# Altium schematic sheet TestV01.SchDoc
size A3
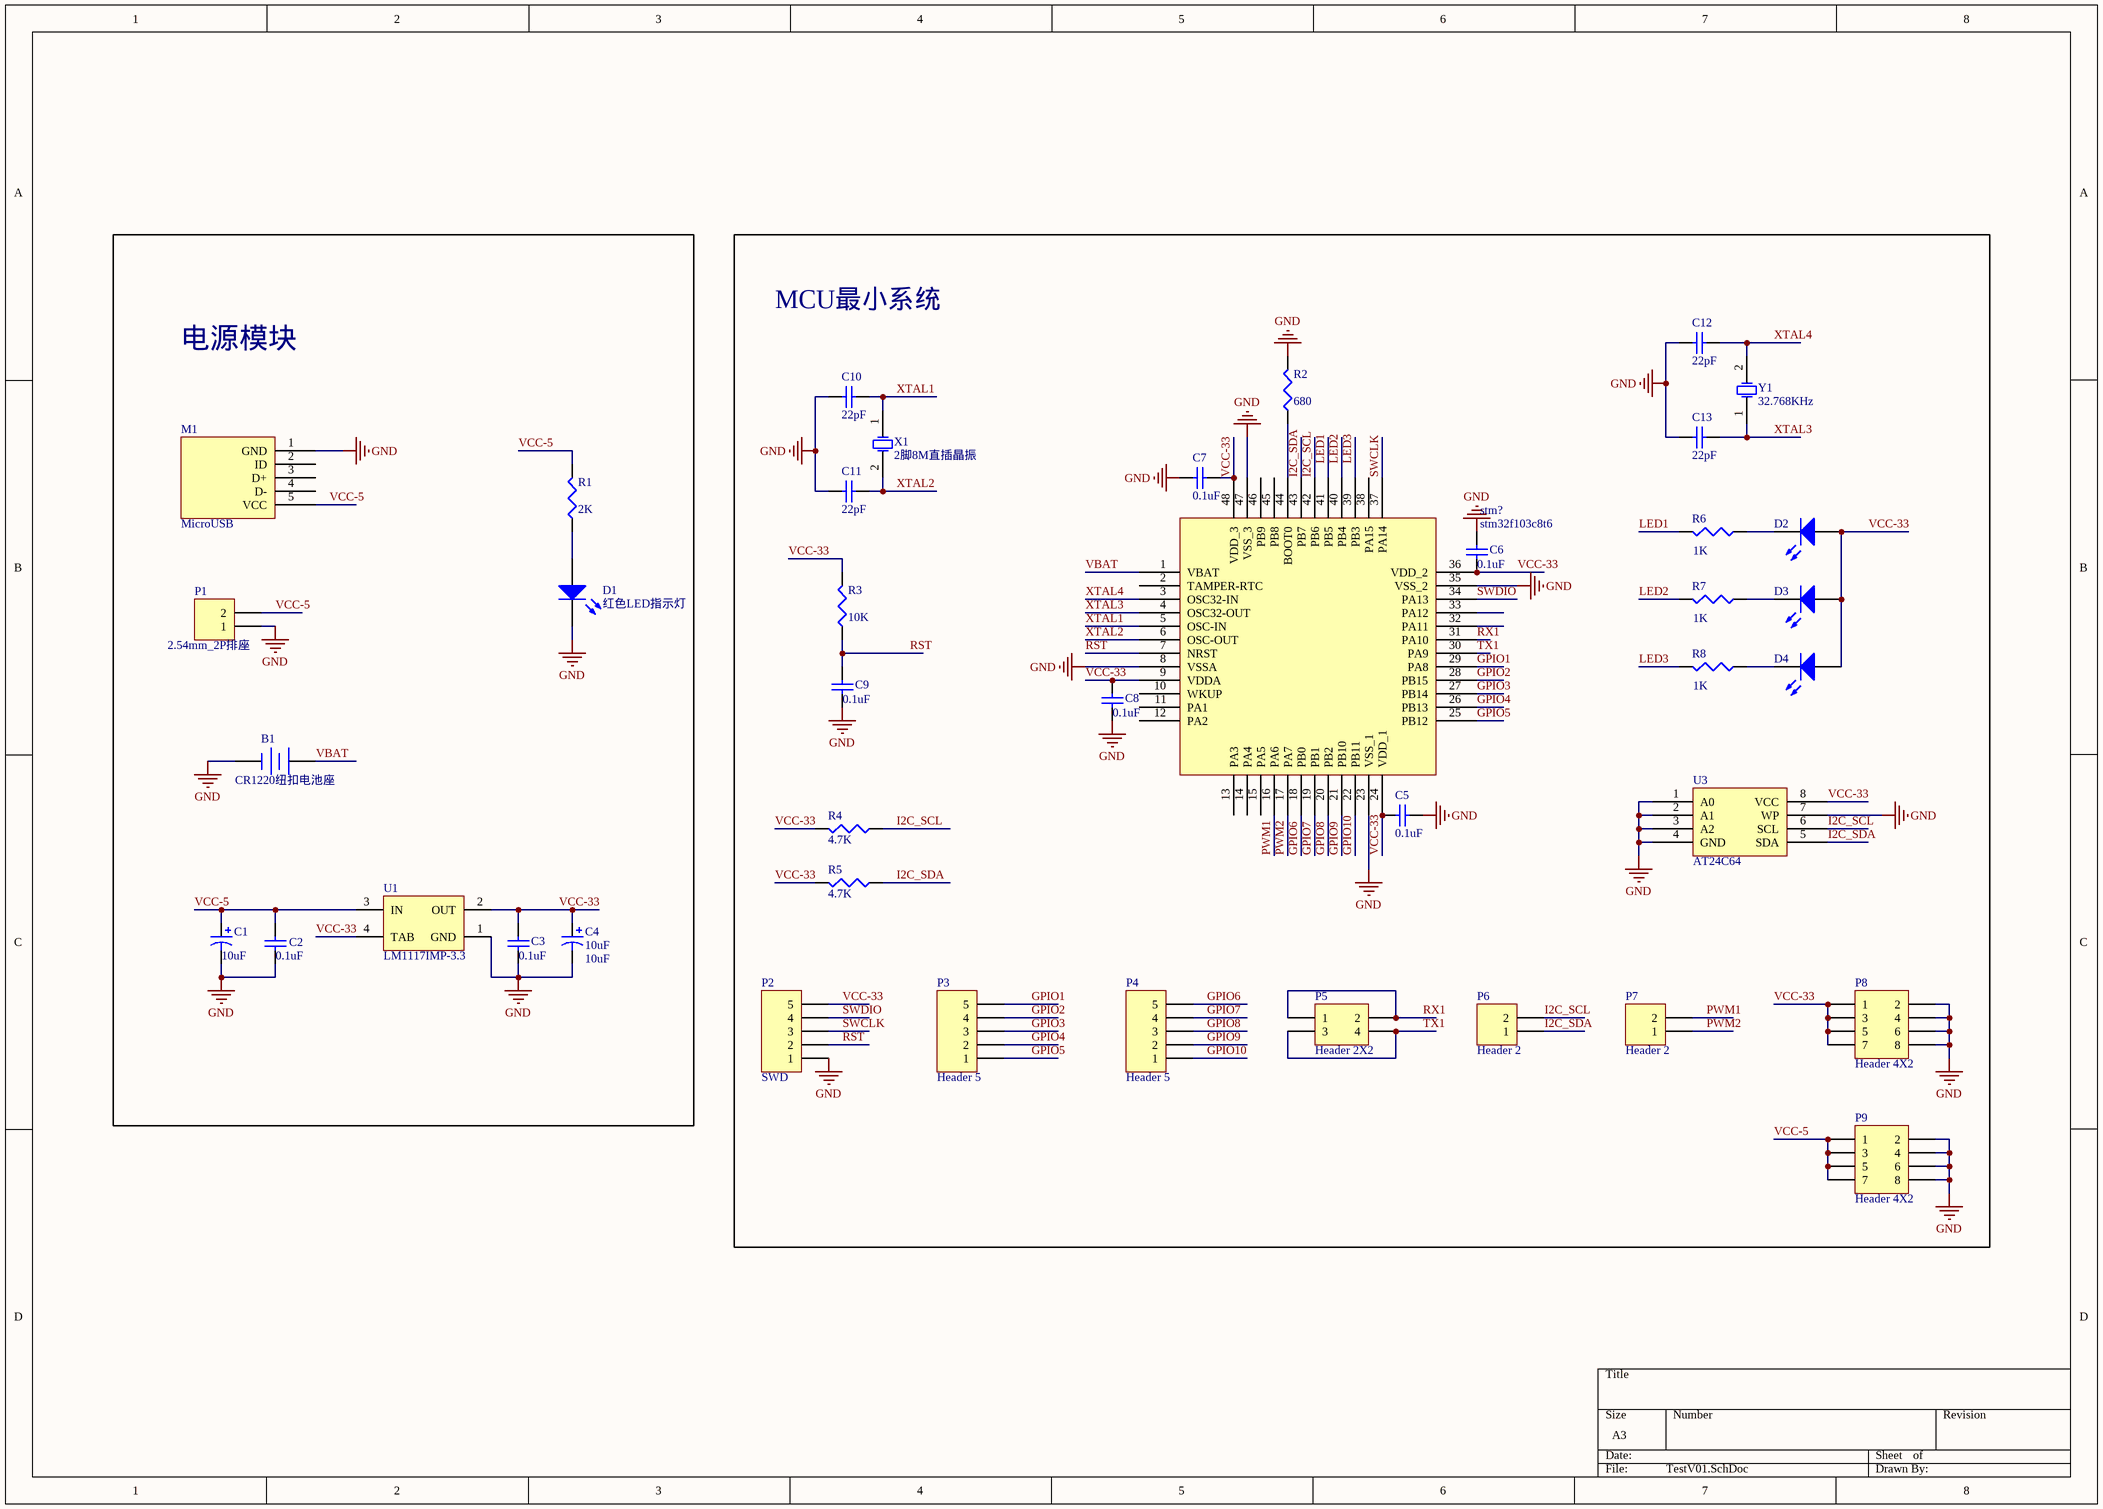
[diagram p0: TestV01.SchDoc]

## Parts
B1  CR1220纽扣电池座  [BAT]
C1  10uF  [C0805]
C2  0.1uF  [1608[0603]]
C3  0.1uF  [1608[0603]]
C4  10uF  [C0805]
C5  0.1uF  [1608[0603]]
C6  0.1uF  [1608[0603]]
C7  0.1uF  [1608[0603]]
C8  0.1uF  [1608[0603]]
C9  0.1uF  [1608[0603]]
C10  22pF  [1608[0603]]
C11  22pF  [1608[0603]]
C12  22pF  [1608[0603]]
C13  22pF  [1608[0603]]
D1  红色LED指示灯  [J1-0603]
D2  红色LED  [J1-0603]  (value not drawn)
D3  绿色LED  [J1-0603]  (value not drawn)
D4  蓝色LED  [J1-0603]  (value not drawn)
M1  MicroUSB  [microusb]
P1  2.54mm_2P排座  [HDR1X2]
P2  SWD  [HDR1X5]
P3  Header 5  [HDR1X5]
P4  Header 5  [HDR1X5]
P5  Header 2X2  [HDR2X2]
P6  Header 2  [HDR1X2]
P7  Header 2  [HDR1X2]
P8  Header 4X2  [HDR2X4]
P9  Header 4X2  [HDR2X4]
R1  2K  [J1-0603]
R2  value 680  [J1-0603]  (hidden comment: 680R)
R3  10K  [J1-0603]
R4  4.7K  [J1-0603]
R5  4.7K  [J1-0603]
R6  1K  [J1-0603]
R7  1K  [J1-0603]
R8  1K  [J1-0603]
stm?  stm32f103c8t6  [stm32f103t8]
U1  LM1117IMP-3.3  [MP04A_N]
U3  AT24C64  [SOIC-8N]
X1  2脚8M直插晶振  [xtal]
Y1  32.768KHz  [R38]

## Blocks framed on the sheet
电源模块: B1 C1-C4 D1 M1 P1 R1 U1

## Nets
GND: B1.2(-) C1.2 C2.1 C3.1 C4.2 C5.1 C6.2 C7.2 C8.1 C9.1 C10.2 C11.2 C12.2 C13.2 D1.2(K) M1.1(GND) P1.1 P2.1 P8.2 P8.4 P8.6 P8.8 P9.2 P9.4 P9.6 P9.8 R2.2 stm?.8(VSSA) stm?.23(VSS_1) stm?.35(VSS_2) stm?.47(VSS_3) U1.1(GND) U3.1(A0) U3.2(A1) U3.3(A2) U3.4(GND) U3.7(WP)
GPIO1: P3.5 stm?.29(PA8)
GPIO2: P3.4 stm?.28(PB15)
GPIO3: P3.3 stm?.27(PB14)
GPIO4: P3.2 stm?.26(PB13)
GPIO5: P3.1 stm?.25(PB12)
GPIO6: P4.5 stm?.18(PB0)
GPIO7: P4.4 stm?.19(PB1)
GPIO8: P4.3 stm?.20(PB2)
GPIO9: P4.2 stm?.21(PB10)
GPIO10: P4.1 stm?.22(PB11)
I2C_SCL: P6.2 R4.1 stm?.42(PB6) U3.6(SCL)
I2C_SDA: P6.1 R5.1 stm?.43(PB7) U3.5(SDA)
LED1: R6.2 stm?.41(PB5)
LED2: R7.2 stm?.40(PB4)
LED3: R8.2 stm?.39(PB3)
PWM1: P7.2 stm?.16(PA6)
PWM2: P7.1 stm?.17(PA7)
RST: C9.2 P2.2 R3.1 stm?.7(NRST)
RX1: P5.1 P5.2 stm?.31(PA10)
SWCLK: P2.3 stm?.37(PA14)
SWDIO: P2.4 stm?.34(PA13)
TX1: P5.3 P5.4 stm?.30(PA9)
VBAT: B1.1(+) stm?.1(VBAT)
VCC-5: C1.1 C2.2 M1.5(VCC) P1.2 P9.1 P9.3 P9.5 P9.7 R1.2 U1.3(IN)
VCC-33: C3.2 C4.1 C5.2 C6.1 C7.1 C8.2 D2.1(A) D3.1(A) D4.1(A) P2.5 P8.1 P8.3 P8.5 P8.7 R3.2 R4.2 R5.2 stm?.9(VDDA) stm?.24(VDD_1) stm?.36(VDD_2) stm?.48(VDD_3) U1.2(OUT) U1.4(TAB) U3.8(VCC)
XTAL1: C10.1 stm?.5(OSC-IN) X1.1(OSC1)
XTAL2: C11.1 stm?.6(OSC-OUT) X1.2(OSC2)
XTAL3: C13.1 stm?.4(OSC32-OUT) Y1.1(OSC1)
XTAL4: C12.1 stm?.3(OSC32-IN) Y1.2(OSC2)
NetD1_1: D1.1(A) R1.1
NetD2_2: D2.2(K) R6.1
NetD3_2: D3.2(K) R7.1
NetD4_2: D4.2(K) R8.1
NetR2_1: R2.1 stm?.44(BOOT0)

Not connected (* = marked no-connect by the designer): M1 2(ID) 3(D+) 4(D-); stm? 2(TAMPER-RTC) 10(WKUP) 11(PA1) 12(PA2) 13(PA3) 14(PA4) 15(PA5) 32(PA11) 33(PA12) 38(PA15) 45(PB8) 46(PB9)

## Notes on the sheet
- MCU最小系统

## Library data of the parts
B1 = BAT
C1 C4 = Cap Pol3: Polarized Capacitor (Surface Mount); Published: 8-Jun-2000; LatestRevisionDate: 29-May-2009; LatestRevisionNote: IPC-7351 Footprint Added.; PackageReference: C0805; Publisher: Altium Limited; PackageDescription: Chip Capacitor; Value: 10uF
C2 C3 C5-C13 = Cap Semi: Capacitor (Semiconductor SIM Model); Published: 8-Jun-2000; LatestRevisionDate: 29-May-2009; LatestRevisionNote: IPC-7351 Footprint Added.; PackageReference: C1206; Publisher: Altium Limited; PackageDescription: Chip Capacitor
  C2 C3 C5-C9: Value: 0.1uF
  C10-C13: Value: 22pF
D1-D4 = LED2: Typical RED, GREEN, YELLOW, AMBER GaAs LED; Published: 8-Jun-2000; LatestRevisionDate: 17-Jul-2002; LatestRevisionNote: Re-released for DXP Platform.; PackageVersion: Feb-2002; PackageReference: 3.2X1.6X1.1; Publisher: Altium Limited; PackageDescription: SM LED; 2 Flat Leads
P1 P6 P7 = Header 2: Header, 2-Pin; LatestRevisionDate: 17-Jul-2002; LatestRevisionNote: Re-released for DXP Platform.; Publisher: Altium Limited
P2-P4 = Header 5: Header, 5-Pin; LatestRevisionDate: 17-Jul-2002; LatestRevisionNote: Re-released for DXP Platform.; Publisher: Altium Limited
P5 = Header 2X2: Header, 2-Pin, Dual row; LatestRevisionDate: 17-Jul-2002; LatestRevisionNote: Re-released for DXP Platform.; Publisher: Altium Limited
P8 P9 = Header 4X2: Header, 4-Pin, Dual row; LatestRevisionDate: 17-Jul-2002; LatestRevisionNote: Re-released for DXP Platform.; Publisher: Altium Limited
R1-R8 = Res3: Resistor; Published: 8-Jun-2000; LatestRevisionDate: 29-May-2009; LatestRevisionNote: IPC-7351 Footprint Added.; PackageReference: J1-0603; Publisher: Altium Limited; PackageDescription: Chip Resistor
  R1: Value: 2K
  R3: Value: 10K
  R4 R5: Value: 4.7K
  R6-R8: Value: 1K
stm? = stm32f103t8
U1 = LM1117IMP-3.3: 800mA Low-Dropout Linear Regulator, 4-pin SOT-223; Manufacturer: National Semiconductor; PackageTopMarking: XYTT*N05B; PowerWise: N; CompType: LDO IC; Published: 4-Dec-2008; DatasheetVersion: Apr-2006; PackageVersion: revB, Apr-2003; PackageReference: MP04A; Publisher: Altium Limited; PackageDescription: Molded SOT-223, 6.50 x 3.56 x 1.6mm Body, 4 Lead, 2.3mm Pitch; Supplier 1: Farnell; Supplier Part Number 1: 7614123; PartNumber: LM1117IMP-3.3; RoHS: N; PinCount: 4; Code_JEDEC: TO-261-AA; Code_IPC: SOT223-4; ComponentLink1Description: LM1117 Datasheet; ComponentLink1URL: http://www.national.com/ds/LM/LM1117.pdf; ComponentLink2Description: LM1117 Web Page; ComponentLink2URL: http://www.national.com/pf/LM/LM1117.html; ComponentLink3Description: MP04A Package Page; ComponentLink3URL: http://www.national.com/packaging/folders/mp04a.html
X1 = XTAL
Y1 = XTAL: Crystal Oscillator; Published: 8-Jun-2000; LatestRevisionDate: 17-Jul-2002; LatestRevisionNote: Re-released for DXP Platform.; PackageReference: R38; Publisher: Altium Limited; PackageDescription: Crystal, Thru-Hole; 2 Leads; Body 3.1 x 8.2 mm (Dia.xH)